# EAGLE board AQ32_v2 (EAGLE 7.3.0)
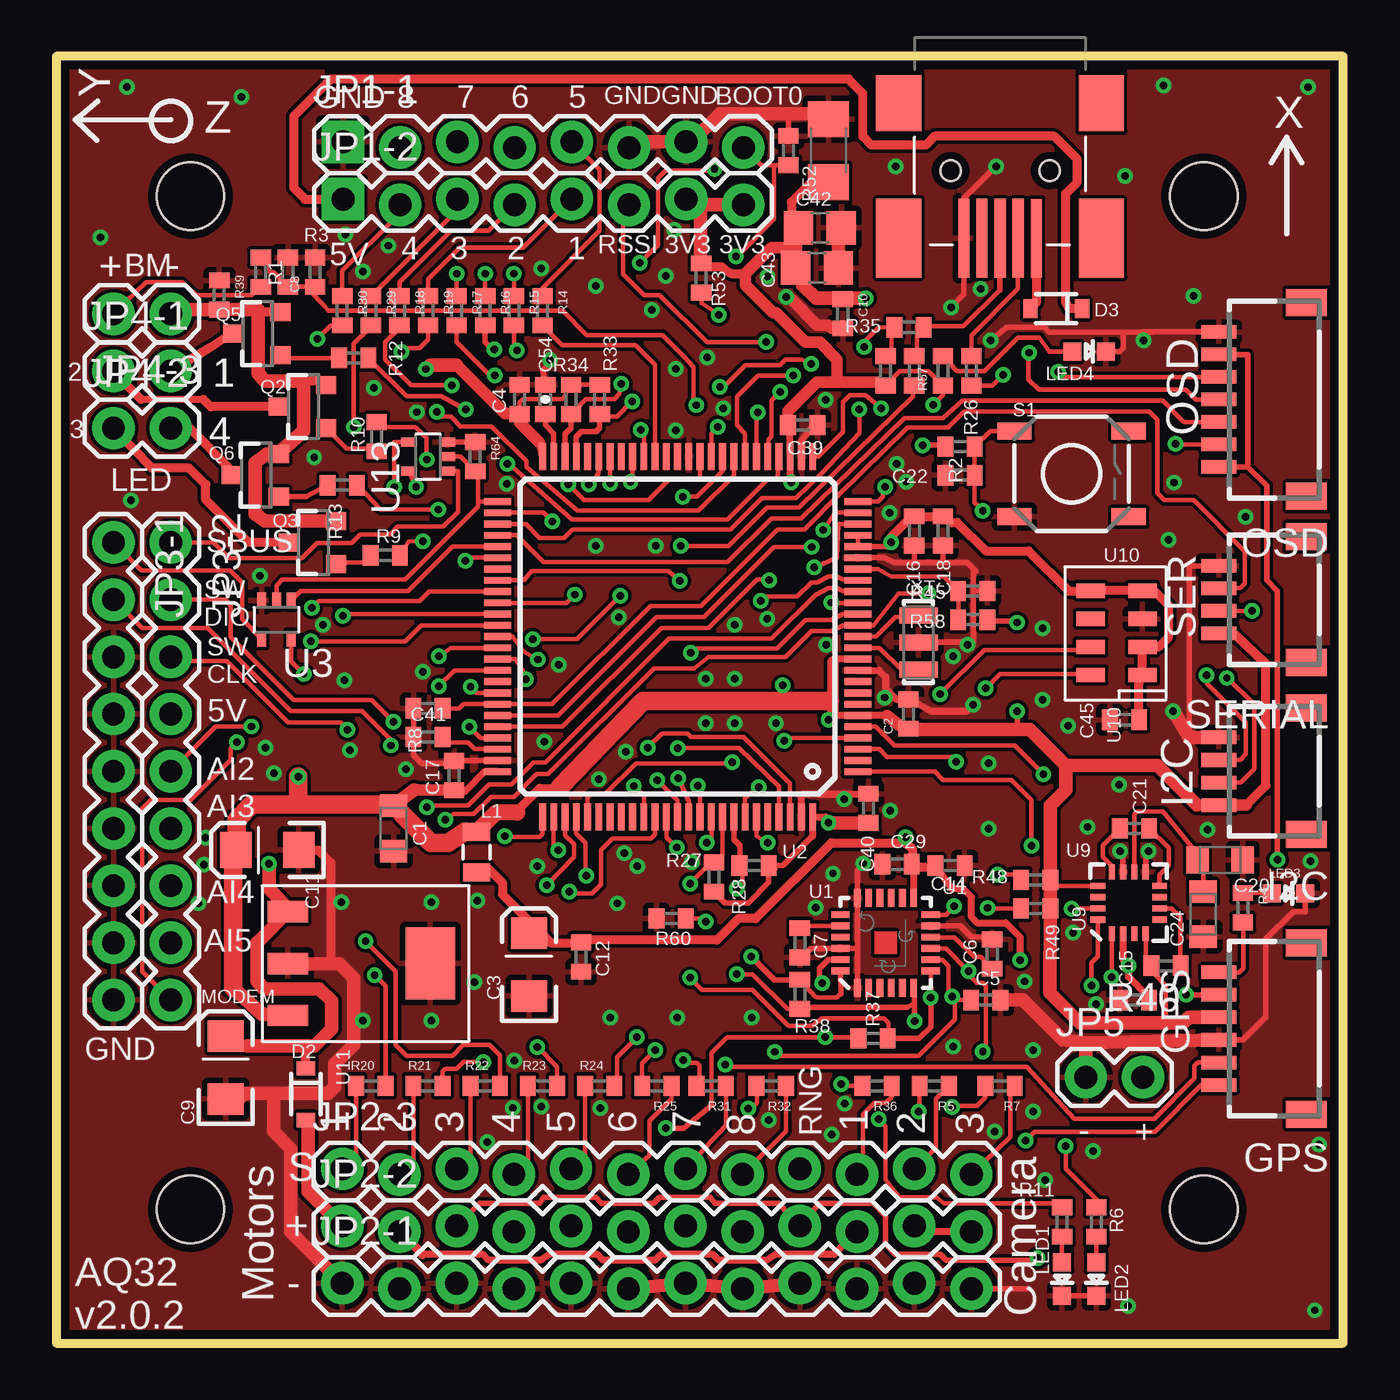
[diagram p1: board, top side]
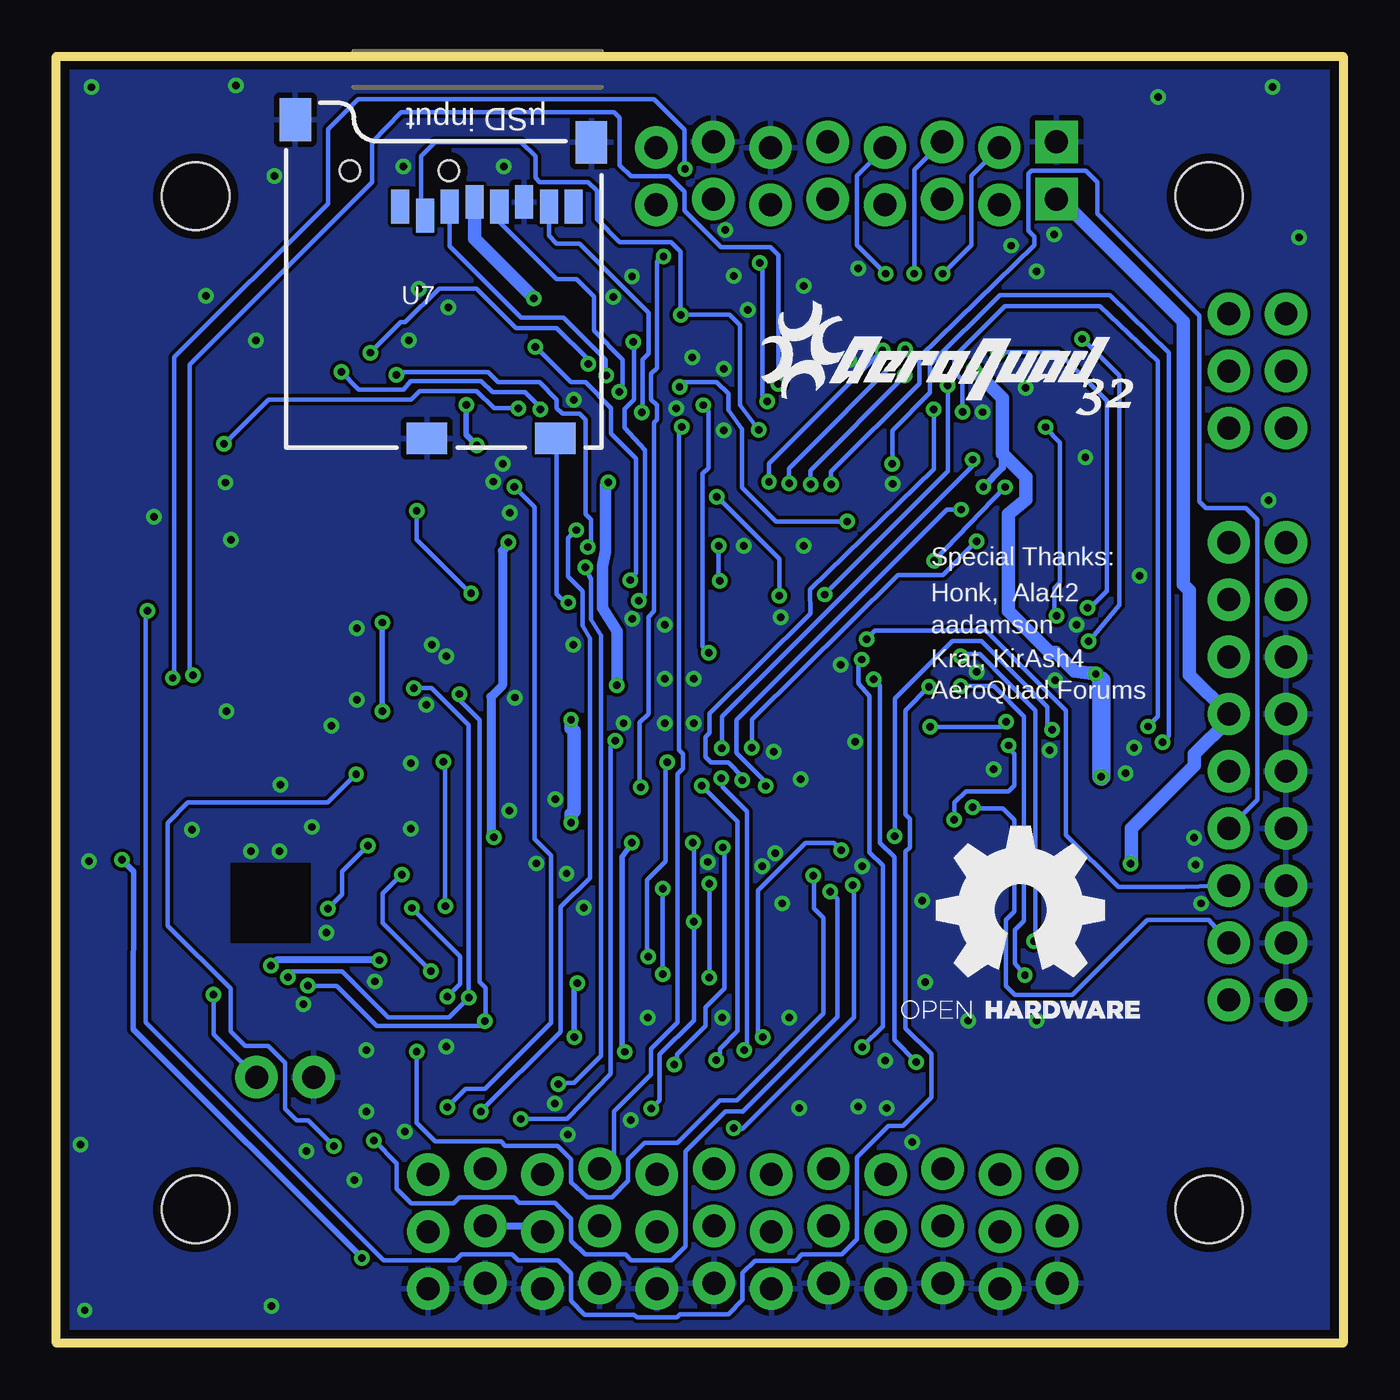
[diagram p2: board, bottom side, seen from below]

Size 57.15 x 57.15 mm. Coordinates in mm from the lower left corner, seen from the top.
Outline: 0,0 57.15,0 57.15,57.15 0,57.15 0,0
Copper layers (1*16): Top 0.0356mm / dielectric 1.5011mm / Bottom 0.0356mm
Design rules "LaenPCBOrder": minimum track width 6mil, minimum drill 13mil, track to track 6mil, track to pad 6mil, pad to pad 6mil, via to via 6mil, smd to smd 6mil, copper to edge 15mil, drill to drill 6mil, minimum pad ring 7mil, minimum via ring 7mil, stop-mask expansion 4mil, vias tented up to drill 0mil, thermal gap 10mil
Net classes: 0 default: width 0.203 mm; 1 vcc: width 0.254 mm
Holes 3 mm at 5.96,50.94 50.96,50.94 50.96,5.94 5.96,5.94
tRestrict: area 46.6,18.5 to 48.6,20.6
bRestrict: area 45.8,17.8 to 49.4,21.3

## Footprints (pad centres in the part's own frame; a part is rotated, then mirrored left to right if it is on the bottom)
SMC_Z = smd 1 x 1.2: + -1,0; - 1,0
C0402 = smd 0.7 x 0.9: 1 -0.65,0; 2 0.65,0
EIA3216 = smd 1.4 x 1.6: A 1.4,0; C -1.4,0
C0805 = smd 1.3 x 1.5: 1 -0.95,0; 2 0.95,0
C1206 = smd 1.6 x 1.8: 1 -1.4,0; 2 1.4,0
0402-CAP = smd 0.7 x 0.9: 1 -0.65,0; 2 0.65,0
SOD-323 = smd 0.63 x 0.83: 1 -1.15,0; 2 1.15,0
SM06B-SRSS-TB = smd 0.6 x 1.55: 1 -2.5,2.975; 2 -1.5,2.975; 3 -0.5,2.975; 4 0.5,2.975; 5 1.5,2.975; 6 2.5,2.975 | smd 1.2 x 1.8: FIT@1 -3.8,-0.9; FIT@2 3.8,-0.9
SM04B-SRSS-TB = smd 0.6 x 1.55: 1 -1.5,2.975; 2 -0.5,2.975; 3 0.5,2.975; 4 1.5,2.975 | smd 1.2 x 1.8: FIT@1 -2.8,-0.9; FIT@2 2.8,-0.9
1X08_LOCK = drill 1.016 pad 1.88 square: 1 0,0.127 | drill 1.016 pad 1.88: 2 2.54,-0.127; 3 5.08,0.127; 4 7.62,-0.127; 5 10.16,0.127; 6 12.7,-0.127; 7 15.24,0.127; 8 17.78,-0.127
1X12_LOCK = drill 1.016 pad 1.88: 1 0,0.127; 2 2.54,-0.127; 3 5.08,0.127; 4 7.62,-0.127; 5 10.16,0.127; 6 12.7,-0.127; 7 15.24,0.127; 8 17.78,-0.127; 9 20.32,0.127; 10 22.86,-0.127; 11 25.4,0.127; 12 27.94,-0.127
1X09 = drill 1.016 pad 1.88: 1 0,0; 2 2.54,0; 3 5.08,0; 4 7.62,0; 5 10.16,0; 6 12.7,0; 7 15.24,0; 8 17.78,0; 9 20.32,0
1X02 = drill 1.016 pad 1.88: 1 0,0; 2 2.54,0
0805 = smd 0.8 x 1.2: 1 -0.9,0; 2 0.9,0
LED-0603 = smd 0.8 x 0.8: A 0,-0.75; C 0,0.75
SM07B-SRSS-TB = smd 0.6 x 1.55: 1 -3,2.975; 2 -2,2.975; 3 -1,2.975; 4 0,2.975; 5 1,2.975; 6 2,2.975; 7 3,2.975 | smd 1.2 x 1.8: FIT@1 -4.3,-0.9; FIT@2 4.3,-0.9
SOT23-3 = smd 0.8 x 0.9: 1 -0.95,-1; 2 0.95,-1; 3 0,1.1
R0402 = smd 0.7 x 0.9: 1 -0.65,0; 2 0.65,0
TACTILE_SWITCH_SMD = smd 1.524 x 0.762: 1 -2.54,1.905; 2 2.54,1.905; 3 -2.54,-1.905; 4 2.54,-1.905
QFN-24 = smd 0.8 x 0.3: 1 -2,1.25; 2 -2,0.75; 3 -2,0.25; 4 -2,-0.25; 5 -2,-0.75; 6 -2,-1.25; 13 2,-1.25; 14 2,-0.75; 15 2,-0.25; 16 2,0.25; 17 2,0.75; 18 2,1.25 | smd 0.3 x 0.8: 7 -1.25,-2; 8 -0.75,-2; 9 -0.25,-2; 10 0.25,-2; 11 0.75,-2; 12 1.25,-2; 19 1.25,2; 20 0.75,2; 21 0.25,2; 22 -0.25,2; 23 -0.75,2; 24 -1.25,2
TQFP100 = smd 1.2 x 0.3: 1 -8,6; 2 -8,5.5; 3 -8,5; 4 -8,4.5; 5 -8,4; 6 -8,3.5; 7 -8,3; 8 -8,2.5; 9 -8,2; 10 -8,1.5; 11 -8,1; 12 -8,0.5; 13 -8,0; 14 -8,-0.5; 15 -8,-1; 16 -8,-1.5; 17 -8,-2; 18 -8,-2.5; 19 -8,-3; 20 -8,-3.5; 21 -8,-4; 22 -8,-4.5; 23 -8,-5; 24 -8,-5.5; 25 -8,-6; 51 8,-6; 52 8,-5.5; 53 8,-5; 54 8,-4.5; 55 8,-4; 56 8,-3.5; 57 8,-3; 58 8,-2.5; 59 8,-2; 60 8,-1.5; 61 8,-1; 62 8,-0.5; 63 8,0; 64 8,0.5; 65 8,1; 66 8,1.5; 67 8,2; 68 8,2.5; 69 8,3; 70 8,3.5; 71 8,4; 72 8,4.5; 73 8,5; 74 8,5.5; 75 8,6 | smd 0.3 x 1.2: 26 -6,-8; 27 -5.5,-8; 28 -5,-8; 29 -4.5,-8; 30 -4,-8; 31 -3.5,-8; 32 -3,-8; 33 -2.5,-8; 34 -2,-8; 35 -1.5,-8; 36 -1,-8; 37 -0.5,-8; 38 0,-8; 39 0.5,-8; 40 1,-8; 41 1.5,-8; 42 2,-8; 43 2.5,-8; 44 3,-8; 45 3.5,-8; 46 4,-8; 47 4.5,-8; 48 5,-8; 49 5.5,-8; 50 6,-8; 76 6,8; 77 5.5,8; 78 5,8; 79 4.5,8; 80 4,8; 81 3.5,8; 82 3,8; 83 2.5,8; 84 2,8; 85 1.5,8; 86 1,8; 87 0.5,8; 88 0,8; 89 -0.5,8; 90 -1,8; 91 -1.5,8; 92 -2,8; 93 -2.5,8; 94 -3,8; 95 -3.5,8; 96 -4,8; 97 -4.5,8; 98 -5,8; 99 -5.5,8; 100 -6,8
SC70-5 = smd 0.4 x 0.7: 1 -0.65,-0.85; 2 0,-0.85; 3 0.65,-0.85; 4 0.65,0.85; 5 -0.65,0.85
MICRO-SD-SOCKET-PP = smd 0.8 x 1.5: 1 -8.94,10.7; 2 -7.84,10.3; 3 -6.74,10.7; 4 -5.64,10.9; 5 -4.54,10.7; 6 -3.44,10.9; 7 -2.34,10.7; 8 -1.24,10.7 | smd 1.8 x 1.4: CD1 -2.05,0.4; CD2 -7.75,0.4 | smd 1.4 x 1.9: GND1 -13.6,14.55; GND3 -0.45,13.55
16LPCC = smd 0.65 x 0.28: 1 -1.37,0.75; 2 -1.37,0.25; 3 -1.37,-0.25; 4 -1.37,-0.75; 9 1.37,-0.75; 10 1.37,-0.25; 11 1.37,0.25; 12 1.37,0.75 | smd 0.28 x 0.65: 5 -0.75,-1.37; 6 -0.25,-1.37; 7 0.25,-1.37; 8 0.75,-1.37; 13 0.75,1.37; 14 0.25,1.37; 15 -0.25,1.37; 16 -0.75,1.37
LGA08A = smd 1.27 x 0.635: 1 -1.15,1.9; 2 -1.15,0.65; 3 -1.15,-0.6; 4 -1.15,-1.85; 5 1.15,-1.85; 6 1.15,-0.6; 7 1.15,0.65; 8 1.15,1.9
TO-223 = smd 3.2 x 2.2: 1 0,6.311 | smd 0.95 x 1.8: 2 -2.3,-0.014; 3 2.3,-0.014; 4 0,-0.014
USB-MINIB-OLD = smd 2.5 x 2: 1 -3,-4.5; 2 -3,4.5 | smd 3.5 x 2: 3 3,-4.5; 4 3,4.5 | smd 3.5 x 0.5: D+ 3,0; D- 3,0.8; GND 3,-1.6; ID 3,-0.8; VBUS 3.01,1.61 | hole 0.9: 0,2.2; 0,-2.2
RESONATOR-SMD = smd 0.7 x 1.7: 1 -1.2,0; 2 0,0; 3 1.2,0

## Placement (x,y rotation side)
C1  4.7uF  [SMC_Z]  14.99,22.86 270 top
C2  0.1uF  [C0402]  37.85,27.94 90 top
C3  10uF  [EIA3216]  20.99,16.82 90 top
C4  0.1uF  [C0402]  20.57,41.91 90 top
C5  10nF  [C0402]  41.27,15.24 0 top
C6  0.1uF  [C0402]  41.56,17.29 90 top
C7  2.2nF  [C0402]  33.02,17.78 270 top
C8  0.1µF  [C0402]  11.49,47.56 90 top
C9  10uF (25V)  [EIA3216]  7.53,12.24 90 top
C10  0.1uF  [C0402]  34.92,45.72 270 top
C11  10uF  [EIA3216]  9.37,21.9 180 top
C12  0.1uF  [C0402]  23.3,17.14 270 top
C14  1uF  [C0402]  39.69,21.21 0 top
C15  0.1uF  [C0402]  47.88,15.24 180 top
C16  1uF  [C0402]  38.1,36.07 270 top
C17  0.1uF  [C0402]  17.66,25.21 90 top
C18  10nF  [C0402]  39.37,36.07 270 top
C20  1uF (ESR)  [SMC_Z]  51.69,21.46 0 top
C21  0.22uF  [C0402]  47.88,22.86 180 top
C22  0.1uF  [C0402]  40.13,38.54 0 top
C24  1uF (ESR)  [SMC_Z]  50.93,19.05 270 top
C29  0.1uF  [C0402]  37.34,21.27 180 top
C39  0.1uF  [C0402]  33.15,40.77 0 top
C40  0.1uF  [C0402]  36.07,23.75 90 top
C41  2.2uF  [C0402]  16.51,26.92 180 top
C42  47uF  [C0805]  33.91,49.53 0 top
C43  10uF  [C0805]  33.78,47.75 0 top
C44  220uF  [C1206]  34.29,52.96 90 top
C45  0.1uF  [C0402]  47.43,27.69 180 top
C54  2.2uF  [0402-CAP]  21.72,41.91 270 top
D2  30V  [SOD-323]  11.08,11.06 270 top
D3  30V  [SOD-323]  44.41,45.94 180 top
GPS  SM06B-SRSS-TB  [SM06B-SRSS-TB]  54.61,13.97 90 top
I2C  SM04B-SRSS-TB  [SM04B-SRSS-TB]  54.61,25.4 90 top
JP1-1  JP1  [1X08_LOCK]  12.73,53.22 0 top
JP1-2  JP1  [1X08_LOCK]  12.73,50.68 0 top
JP2-1  M12LOCK  [1X12_LOCK]  12.7,2.54 0 top
JP2-2  M12LOCK  [1X12_LOCK]  12.7,5.08 0 top
JP2-3  M12LOCK  [1X12_LOCK]  12.7,7.62 0 top
JP3-1  M09  [1X09]  2.54,35.56 270 top
JP3-2  M09  [1X09]  5.08,35.56 270 top
JP4-1  JP4  [1X02]  2.54,43.18 0 top
JP4-2  JP4  [1X02]  2.54,40.64 0 top
JP4-3  JP4-3  [1X02]  5.08,45.72 180 top
JP5  [1X02]  45.72,11.81 0 top
L1  100uH  [0805]  18.67,21.81 270 top
LED1  Blue  [LED-0603]  44.66,2.85 180 top
LED2  Green  [LED-0603]  46.19,2.85 180 top
LED3  Blue  [LED-0603]  54.73,19.97 270 top
LED4  Blue  [LED-0603]  45.87,44.04 270 top
OSD  SM07B-SRSS-TB  [SM07B-SRSS-TB]  54.61,41.91 90 top
Q2  BCV27  [SOT23-3]  10.99,41.59 90 top
Q3  BCV27  [SOT23-3]  11.43,35.56 90 top
Q5  BCV27  [SOT23-3]  8.95,44.83 90 top
Q6  BCV27  [SOT23-3]  8.89,38.54 90 top
R1  10K  [C0402]  9.08,47.56 270 top
R2  10K  [C0402]  40.13,39.81 180 top
R3  1k5  [C0402]  10.29,47.56 270 top
R4  330  [C0402]  52.69,19.34 270 top
R5  1K  [C0402]  38.99,11.43 180 top
R6  330  [C0402]  46.19,5.39 270 top
R7  1K  [C0402]  41.91,11.43 180 top
R8  10k  [R0402]  16.51,28.19 0 top
R9  1k69  [C0402]  14.61,34.99 180 top
R10  1k69  [C0402]  14.22,40.26 270 top
R11  330  [C0402]  44.66,5.39 90 top
R12  1k69  [C0402]  13.21,43.75 180 top
R13  1k69  [C0402]  12.7,38.1 180 top
R14  1K  [C0402]  21.59,45.85 270 top
R15  1K  [C0402]  20.32,45.85 270 top
R16  1K  [C0402]  19.05,45.85 270 top
R17  1K  [C0402]  17.78,45.85 270 top
R18  1K  [C0402]  15.24,45.85 270 top
R19  1K  [C0402]  16.51,45.85 270 top
R20  1K  [C0402]  13.97,11.43 0 top
R21  1K  [C0402]  16.51,11.43 0 top
R22  1K  [C0402]  19.05,11.43 0 top
R23  1K  [C0402]  21.59,11.43 0 top
R24  1K  [C0402]  24.13,11.43 0 top
R25  1K  [C0402]  26.67,11.43 180 top
R26  22R  [C0402]  40.64,43.18 90 top
R27  4k7  [C0402]  29.21,20.7 90 top
R28  4k7  [C0402]  30.99,21.21 180 top
R29  1K  [C0402]  13.97,45.85 270 top
R30  1K  [C0402]  12.7,45.85 270 top
R31  1K  [C0402]  29.08,11.43 180 top
R32  1K  [C0402]  31.75,11.43 180 top
R33  4k7  [C0402]  24.13,41.91 270 top
R34  4k7  [C0402]  22.86,41.91 270 top
R35  22R  [C0402]  37.87,45.11 0 top
R36  1K  [C0402]  36.45,11.43 180 top
R37  0R  [R0402]  36.27,13.54 0 top
R38  0R  [R0402]  33.02,15.49 270 top
R39  0R  [C0402]  7.24,46.55 270 top
R40  0R  [R0402]  49.28,16.76 180 top
R45  0R  [R0402]  40.7,33.4 180 top
R48  4k7  [C0402]  43.5,20.57 180 top
R49  4k7  [C0402]  43.5,19.3 180 top
R52  10K  [C0402]  32.51,52.96 270 top
R53  4k7  [C0402]  28.64,47.31 270 top
R57  330  [C0402]  39.37,43.18 90 top
R58  0R  [R0402]  40.7,32.13 180 top
R60  10k  [R0402]  27.3,18.86 180 top
R61  1K5  [R0402]  36.83,43.18 90 top
R62  220R  [C0402]  38.1,43.18 270 top
R64  10K  [C0402]  18.61,39.37 270 top
S1  SW-MOM  [TACTILE_SWITCH_SMD]  45.09,38.61 0 top
SERIAL  SM04B-SRSS-TB  [SM04B-SRSS-TB]  54.61,33.02 90 top
U1  ITG-3200  [QFN-24]  36.83,17.78 90 top
U2  STM32F10XVXT6  [TQFP100]  27.59,31.38 180 top
U3  74AHC1G86DCK  [SC70-5]  9.78,32.13 180 top
U7  USD-SOCKETNEW  [MICRO-SD-SOCKET-PP]  32.94,39.78 0 bottom
U9  HMC5883LSMD  [16LPCC]  47.62,19.56 90 top
U10  MS5611  [LGA08A]  47.08,31.57 180 top
U11  MIC5239  [TO-223]  10.3,16.86 270 top
U13  74AHC1G86DCK  [SC70-5]  16.51,39.37 90 top
U$4  [AQ-WORDS-PT07]  25.84,40.87 0 bottom
U$5  [OSHW_TEXT]  19.62,14.41 0 bottom
X2  USBOLD  [USB-MINIB-OLD]  41.91,52.07 270 top
XT  8MHz  [RESONATOR-SMD]  38.29,31.11 270 top

## Tracks (layer width: path | path; a pad name or v marks a point on that pad's centre or on a via)
3V3AN  (via drill 0.33 pad 0.69)
  Top 0.203: U2.21 U2.22 | C18.1 39.41,36.72 39.68,36.45 | C3.A 20.99,18.32 21.21,18.54
  Top 0.254: 37.85,36.58 37.96,36.58 C16.1 | 45.97,33.59 U10.5 45.91,33.4 | 48.77,33.4 48.63,33.4 U10.4 | 48.08,29.31 U10.1 | U2.21 36.9,35.38 v37.08,35.56 | C29.1 38.08,21.14
  Top 0.305: U1.13 38.08,21.14 | v37.72,22.48 37.72,22.19 | v42.8,17.02 42.8,18.03 42.16,18.67 40.89,18.67 40.64,18.92 40.64,19.81 40.26,20.19 39.75,20.19 C14.1 | C15.1 48.53,15.35 47.62,16.26 v47.62,16.76 47.38,17.01 U9.2
  Top 0.406: U10.1 U10.2 48.95,30.92 49.4,31.37 49.4,32.77 48.77,33.4 | U10.4 U10.5 | v37.08,35.56 37.08,35.81 37.85,36.58 | C16.1 C18.1 | C45.1 48.08,29.31 | L1.2 19.22,21.04 19.81,20.45 19.81,19.94 21.21,18.54 21.97,17.78 23.07,17.78 C12.1 23.67,17.91 29.34,17.91 30.29,18.86 31.05,18.86 34.42,22.23 37.47,22.23 v37.72,22.48 | 37.72,22.19 38.01,21.97 38.01,21.3 C29.1 | 39.68,36.45 40.01,36.45 41.27,35.18 43.18,35.18 44.96,33.4 45.91,33.4 | 38.08,21.14 38.97,21.14 C14.1
  Bottom 0.254: 37.85,22.61 v37.72,22.48
  Bottom 0.305: v42.8,17.02 47.37,17.02 v47.62,16.76
  Bottom 0.406: v37.08,35.56 37.34,35.18 37.34,29.21 37.85,28.7 37.85,22.61
3V3DIG  (via drill 0.33, 0.33 pad 0.69)
  Top 0.203: R58.1 41.51,32.07 | U13.5 16.01,37.96 16.01,38.06 v15.98,38.02 | R28.1 31.95,21.07 | 33.59,22.58 33.59,22.53 | 33.59,22.53 | R61.1 36.83,42.55 37.47,43.18 38.73,43.18 38.73,43.16 R57.1 39.37,42.1 v38.95,41.67 | C4.1 20.57,41.78 20.72,41.93 22.48,41.93 R34.1 R33.1 | U9.13 44.41,20.31 R48.1 | U9.4 48.38,17.02 R40.2 48.75,16.4 49.28,15.88 49.28,14.47 49.53,14.22 | 49.28,14.22 49.78,14.22 | U3.5 10.43,30.27 v10.99,29.72 | C10.1 34.16,46.41
  Top 0.254: C44.1 33.52,51.56 | 32.64,49.81 32.64,49.59 C42.1 | 41.51,32.07 42.61,32.07 v42.67,32 | v42.67,28.07 42.67,27.5 42.92,27.25 | v38.48,39.88 39.42,39.88 R2.2 | 33.59,22.53 32.27,21.21 R28.1 31.64,20.46 30.73,19.56 29.7,19.56 R27.1 | 32.59,38.28 v32.64,38.23 | 32.59,40.8 C39.1
  Top 0.305: 36.89,27.88 U2.6 34.48,27.88 34.29,27.75 v34.29,27.69 | 33.59,22.53 U2.100 34.17,23.38 v34.29,23.11 | 34.35,28.52 34.48,28.64 | 44.8,24.66 44.84,24.57 | 52.39,31.43 51.72,31.43 SERIAL.1 | R53.1 29,47.8 | U2.50 21.46,40.01 | 20.43,41.27 C4.1 | C40.1 36.07,23.11 | C2.1 37.85,27.39 | U2.75 19.03,25.38 18.16,24.51 17.74,24.51 C17.1 | 32.59,38.28 U2.28 32.59,40.8 | U2.11 34.61,30.38 34.48,30.25
  Top 0.406: 38.08,27.27 37.85,27.39 37.5,27.39 | 52.39,31.43 53.72,30.16 53.72,24.77 52.86,23.9 | 33.52,51.56 32.64,50.67 32.64,49.81 | 29,47.8 29.54,47.8 29.97,47.5 30.61,47.5 | C11.A 8.03,21.9 7.85,21.97 | 10.24,14.61 U11.3 | L1.1 18.9,22.73 18.16,22.73 | C1.+ 14.73,23.93 15.37,24.18 15.37,23.5 | I2C.1 50.65,23.9 | 20.47,23.56 20.47,23.64 21.46,24.64 22.23,24.64 22.35,24.68 | v32.26,29.21 32.26,28.64 32.13,28.52 | 32.64,41.04 C39.1 | 36.81,42.55 R61.1 36.56,42.67
  Top 0.508: 37.5,27.39 36.89,27.88 | 34.48,27.88 34.48,28.64 34.48,30.25 | 21.46,40.01 20.57,40.89 C4.1 | 17.78,43.43 19.94,41.27 20.43,41.27 | 15.88,24.56 C17.1 | C39.1 32.5,41.39 33.78,42.67 34.54,42.67 | I2C.1 52.86,23.9 | 34.54,42.67 36.56,42.67 | 32.83,48.64 31.75,48.64 30.61,47.5 30.61,46.99 31.83,45.77 31.96,45.77 33.27,44.45 33.91,44.45 34.67,43.69 34.67,42.8 34.54,42.67
  Top 0.61: GPS.4 50.28,14.47 50.03,14.22 49.78,14.22 49.53,14.22 45.46,14.22 44.12,15.56 R49.1 R48.1 44.15,23.89 44.84,24.57 44.84,25.65 | 17.78,43.43 16.59,43.43 v16.42,43.26 | v34.29,23.11 36.07,23.11 | JP1-2.7 28.61,50.56 | 28.61,50.56 JP1-2.8 | 7.85,15.78 9.14,14.61 10.24,14.61 | 15.37,24.18 15.88,24.56 | 50.65,23.9 48.9,25.65 44.84,25.65 | 44.84,25.65 43.24,27.25 42.92,27.25 37.88,27.25 C2.1 | R53.1 28.61,47.96 28.61,50.56 | C43.1 32.83,48.64 32.83,49.4 C42.1 | 33.02,47.56 C43.1 | v35.94,46.41 34.16,46.41 33.73,46.41 33.15,46.99 33.15,47.44 C43.1
  Top 0.711: 20.47,23.56 19.52,23.56 L1.1
  Top 0.813: 34.35,28.52 32.13,28.52 26.05,28.52 22.35,24.68 | 7.85,21.97 7.85,15.78 | 15.37,23.5 16.64,22.23 17.4,22.23 18.16,22.73 | 14.73,23.93 10.79,23.93 | 10.79,23.93 8.69,23.93 8,23.24 8,21.93 C11.A | v10.74,25.16 10.74,23.98 10.79,23.93
  Bottom 0.203: 11.15,29.75 v10.99,29.72
  Bottom 0.254: v42.67,32 v42.67,28.07 | v38.95,41.67 38.95,40.34 v38.48,39.88
  Bottom 0.305: v15.98,38.02 15.12,38.88 15.12,39.5
  Bottom 0.406: v32.64,38.23 32.77,38.1
  Bottom 0.508: 32.77,38.1 32.77,35.18 32.89,34.54 32.89,32.64 32.26,31.62 v32.26,29.21
  Bottom 0.61: 10.74,29.44 11.15,29.75 | v34.29,23.11 34.29,23.5 34.16,23.62 34.16,27.18 34.29,27.3 v34.29,27.69 | v10.99,29.72 11.94,29.84 12.76,30.67 13.02,30.67 14.86,32.51 14.86,36.83 14.1,37.47 14.1,38.47 15.12,39.5 15.12,41.96 v16.42,43.26 | U7.4 38.58,49.04 v35.94,46.41
  Bottom 0.813: v10.74,25.16 10.74,29.44
5V-1
  Top 0.406: 11.18,9.81 D2.2
  Top 0.61: JP2-2.1 11.18,6.73 11.18,9.81
5V-2
  Top 0.305: JP2-2.10 34.54,3.94 31.93,3.94 31.55,3.68 29.43,3.68 29.17,3.94 26.85,3.94 26.59,3.68 24.28,3.68 24.03,3.94 21.89,3.94 21.51,3.68 19.2,3.68 18.95,3.94 16.26,3.94 | JP2-2.12 38.35,4.95 JP2-2.11
  Top 0.406: 16.26,3.94 JP2-2.2
  Bottom 0.305: JP2-2.11 35.81,5.21 JP2-2.10
5V-3  (via drill 0.33)
  Top 0.254: 52.92,38.91 53.75,38.08 53.75,33.88 54.23,33.4 v54.23,21.46 | JP2-2.3 18.8,6.22 21.45,6.22 21.64,6.48 23.96,6.48 24.22,6.22 26.53,6.22 26.79,6.48 29.05,6.48 29.25,6.21 32.08,6.21 JP2-2.9 33.9,6.21 36.28,6.21 36.83,5.66 36.83,4.42 37.24,3.95 39.26,3.95 39.52,3.68 43.57,3.68 v43.57,3.78 | OSD.1 52.92,38.91 | OSD.6 52.92,43.91 52.92,38.91
  Bottom 0.203: v43.57,3.78 v43.58,3.78
  Bottom 0.254: v54.23,21.46 53.72,20.95 53.73,13.93 v43.58,3.78
5VIN  (via drill 0.33 pad 0.69)
  Top 0.254: U11.2 10.46,19.16
  Top 0.305: 12.68,50.86 JP1-2.1
  Top 0.406: D2.1 11.08,13.2 | 8.48,13.2 C9.A | 8.91,17.81 8.93,17.81 | D3.1 44.99,45.94 44.83,46.23 44.83,51.05 45.34,51.56 45.34,52.58 44.32,53.59 38.99,53.59 38.61,53.21 36.2,53.21 35.81,53.59 35.81,55.5 35.18,56.13 12.19,56.13 10.54,54.48 10.54,51.31 11.05,50.8 JP1-2.1
  Top 0.61: 8.91,17.81 8.91,16.07 9.24,15.74 11.68,15.74 12.23,15.19 12.23,13.95 11.48,13.2 11.08,13.2 8.48,13.2 | 10.46,19.16 9.45,20.17 v9.45,21.29 | 8.93,17.81 U11.2
  Bottom 0.61: JP1-2.1 12.6,50.86 7.1,45.36 7.1,33.7 6.82,33.42 6.82,29.68 JP3-2.4 5.08,27.69 6.6,26.16 6.6,25.65 9.4,22.86 9.4,21.34 v9.45,21.29
ADC12_IN14  (via drill 0.33 pad 0.69)
  Top 0.203: U2.33 30.09,38.53 28.53,36.97 23.14,36.97 20.87,38.91 20.87,39.17 19.33,40.72 17.96,40.72 17.53,41.15 17.12,41.15 v16.9,41.36 | v8.67,27.39 7.07,27.39 JP3-2.5
  Bottom 0.203: v8.67,27.39 8.23,27.84 8.23,43.62 10.8,46.06 15.02,46.06 17.27,43.81 17.27,43.14 16.9,42.77 v16.9,41.36
ADC12_IN15  (via drill 0.33 pad 0.69)
  Top 0.203: v25.04,33.19 23.12,31.27 v21.15,31.27 | U2.34 29.59,38.72 28.46,37.59 v27.82,37.59
  Bottom 0.203: v21.15,31.27 20.79,31.66 15.88,31.66 12.32,28.1 12.32,22.57 9.99,20.25 7.05,20.25 JP3-2.7 | v27.82,37.59 25.04,34.82 v25.04,33.19
ADC123_IN10  (via drill 0.33 pad 0.69)
  Top 0.203: R1.1 9.48,47.56 9.65,47.56 10.03,47.18 R3.2 C8.1 11.18,46.8 11.94,46.04 12.06,45.85 22.48,45.85 23.56,44.77 26.92,44.77 27.88,43.81 28.3,43.34 28.3,41.79 v28.42,41.66 | v28.17,30.66 28.37,30.86 32,30.86 33.27,32.13 34.41,32.13 34.92,32.38 U2.15
  Bottom 0.203: v28.42,41.66 28.38,41.53 28.19,41.4 28.19,38.86 28.45,38.61 28.45,30.94 v28.17,30.66
ADC123_IN11  (via drill 0.33 pad 0.69)
  Top 0.203: U2.16 34.56,32.88 v34.42,32.89
  Bottom 0.203: v34.42,32.89 34.54,32.89 34.92,33.27 34.92,39.35 U7.CD1
ADC123_IN12  (via drill 0.33 pad 0.69)
  Top 0.203: v16.45,23.8 16.65,23.88 18.29,23.88 19.22,24.81 20.22,24.81 21.19,25.78 21.72,25.78 27.22,31.28 31.77,31.28 33.74,33.25 33.76,33.25 34.29,33.53 34.67,33.53 34.92,33.4 35.57,33.4 U2.17
  Bottom 0.203: JP3-2.8 5.97,18.8 8.7,18.8 12.02,15.47 14.58,15.47 14.99,15.88 14.99,18.8 14.61,19.18 14.61,23.24 15.11,23.75 16.4,23.75 v16.45,23.8
ADC123_IN13  (via drill 0.33 pad 0.69)
  Top 0.203: v31.28,32.97 31.47,33.16 32.9,33.16 33.53,33.78 33.78,33.78 34.29,34.04 34.67,34.04 34.92,33.91 35.56,33.91 U2.18 | v31.52,44.46 31.51,44.45 28.89,44.45 26.8,46.55 26.1,46.55 25.18,47.47 25.18,50.3 JP1-2.6
  Bottom 0.203: v31.28,32.97 31,33.25 31,39.67 31.92,40.66 31.92,41.49 31.5,41.91 31.5,44.44 v31.52,44.46
BOOT0  (via drill 0.33 pad 0.69)
  Top 0.203: 30.11,48.39 30.18,48.45 v30.18,48.26 30.22,48.26 31.88,49.91 31.88,52.31 | U2.94 30.59,24.22 v31.19,24.7 | R52.2 31.88,52.31 | 31.88,52.31 31.3,52.31 JP1-1.8
  Bottom 0.203: 31.18,24.84 v31.19,24.7 31.24,24.75 31.24,27.56 30.86,27.94 30.86,32.26 30.61,32.51 30.61,40.89 30.48,41.02 30.48,41.66 30.73,41.91 30.73,43.05 30.48,43.31 30.48,48.02 v30.18,48.26
GND  (via drill 0.33 pad 0.69)
  Top 0.254: 40.72,34.41 40.72,33.4 | v21.93,43.66 21.93,43.53 21.59,43.19 C54.1 | 17.11,40.02 U13.3 R64.1 | 50.33,26.9 50.33,34.52 SERIAL.4 | C7.2 33.37,17.38 33.51,17.53 U1.22 35.58,17.53 | R8.1 C41.2 15.86,26.1 16.22,25.73 17.63,25.73 | U2.74 17.65,25.88 17.63,25.73 | LED3.C 55.48,19.16 54.92,19.16 53.72,17.96 53.72,14.5 52.69,13.47 GPS.3 | 40.72,33.4 40.72,31.14 39.07,31.13 XT.2 | 43.1,2.41 JP2-1.12 | LED2.C LED1.C | v35.82,21.3 35.58,21 U1.18 35.58,17.53 | U1.1 35.58,17.53 | 47.39,44.91 44.09,44.91 43.88,45.12 42.21,45.12 v41.49,44.53 | LED4.C 47.22,44.04 47.39,44.21 47.39,44.91 | OSD.7 48.27,44.92 48.26,44.91 | v39.74,46 40.31,46.58 X2.GND 40.31,50.84 v41.73,52.26 | 47.39,44.91 48.26,44.91 | 48.26,44.91 48.73,44.91 | 17.63,25.73 C17.2 | R45.1 40.72,33.4 | 39.37,34.66 38.1,34.66 | 38.1,34.66 37.22,34.66 36.75,34.88 U2.20 | C16.2 38.1,34.66 | C18.2 39.37,34.66 | 39.37,34.66 40.47,34.66 40.72,34.41 | R52.1 32.51,54.61 | 40.84,34.29 40.72,34.41 | U9.11 47.38,21.71 v47.24,21.84 | U9.9 48.38,21.7 v48.51,21.84 | U1.11 40.14,18.53 40.64,18.03 41.53,18.03 C6.2 | 35.05,49.53 C42.2 34.73,49.4 | 34.42,53.72 34.42,54.23 C44.2
  Top 0.305: U2.99 33.09,24.33 33.15,24.38 35.83,24.38 C40.2 | U2.10 36.54,29.88 36.83,29.59 36.83,29.08 37.34,28.57 37.83,28.57 | 37.83,28.57 C2.2 | 37.83,28.57 37.97,28.57 38.86,28.07 40.44,28.07 v40.72,28.36 | U2.27 33.09,40.08 33.66,40.77 33.66,41.01 C39.2
  Top 0.406: 17.39,17.58 17.38,17.59 | 7.37,10.54 8.1,10.82 | C11.C 11.63,21.9 12.19,21.34 12.19,16.84
  Top 0.508: C10.2 34.43,45.07 34.29,45.21 33.78,45.21 32.64,46.35 32.51,46.35 32.38,46.48
  Top 0.61: JP2-1.6 JP2-1.7 JP2-1.8 JP2-1.9 | JP1-1.6 25.81,53.35 JP1-1.7 28.2,53.35 29.46,54.61 32.51,54.61 34.04,54.61 | I2C.4 50.33,26.9 49.63,28.04 v49.6,28.07 | C9.C 8.1,10.82 8.37,11.09 9.65,11.09 | U11.4 11.07,16.84 12.19,16.84 12.58,16.84 13.21,16.21 13.21,13.25 12.37,12.41 12.37,11.39 12.07,11.09 9.65,11.09 | U11.1 17.38,16.87 17.38,17.59 16.49,18.06 | JP2-1.1 10.41,4.95 10.41,8.64 9.65,9.4 9.65,11.09 | GPS.3 45.72,13.34 | 45.72,13.34 44.7,13.47 42.93,15.24 C5.2 | JP5.1 45.72,13.34 | C43.2 34.73,49.4
  other vias: 34.17,41.89 41.4,22.84 47.2,24.8 14.11,42.43 47.59,1.65 46.05,8.53 41.04,46.82 37.32,39.04 37.75,38.26 31.58,47.37 32.42,46.47 49.17,55.85 18.69,19.66 16.66,14.32 16.66,19.59 6.62,22.45 9.67,25.31 6.31,19.53 6.56,21.24 16.28,29.82 12.78,29.44 20.34,12.54 21.55,10.51 24.15,10.45 31.96,27.53 40.47,31.02 31.58,32.17 30.12,27.53 25.29,26.26 22.31,30.13 28.21,21.37 24.98,32.23 26.63,35.4 23.96,35.4 39.83,30.52 8.21,55.34 27.52,43.28 3.13,55.79 23.96,46.96 27.58,14.45 35.01,10.64 25.8,21.18 43.38,10.29 34.43,9.27 41.66,9.4 31.63,9.91 55.89,1.46 24.59,14.45 36.79,28.67 27.52,40.55 1.96,49.1 11.45,39.34 28.85,29.5 18.56,16.04 34.18,31.02 49.39,35.68 43.38,13.02 46.17,15.05 39.83,13.18 30.12,29.5 13.61,14.32 12.66,19.59 11.83,31.91 29.62,41.52 13.04,26.32 3.32,37.44 9.29,26.45 47.47,51.84 37.28,52.26 30.88,14.45 56.08,8.83 28.91,43.79 34.49,20.86 55.59,55.78 30.12,31.91 37,36.88 48.28,44.53 50.5,46.52 20.28,10.45 15.51,25.5 12.85,49.25 16.01,41.35 20.01,38.17 24.09,25.05 28.85,27.53 25.23,21.75 27.07,47.41 19.13,8.93 43.91,7.24 26.44,45.88 27.45,49.44 43.8,31.74 43.8,28.57 44.94,27.42 49.64,38.22 37.03,23.65 35,24.16 55.7,21.4 21.67,26.71 45.79,22.93 51.13,22.8 41.4,25.76 52.82,36.69 14.75,48.74 13.61,47.6 21.55,47.72 24.91,19.53 21.36,21.18 33.73,19.34 43,16.07 45.16,18.23 9.04,34.07
  pour Bottom: -0.1,57.08 57.01,57.02 57.1,-0.06 -0.15,0.06
  pour Top: 0,57.15 57.15,57.15 57.15,0 0,0
GND2
  Top 0.406: 8.26,45.91 8.38,45.91 | Q2.2 11.79,42.74 10.73,42.74 10.99,42.61 | 9.89,39.54 Q6.2 9.33,39.49 | Q5.2 8.96,45.78 8.95,45.78
  Top 0.61: JP4-3.1 5.83,45.9 R39.2 8.26,45.91 | 8.38,45.91 8.95,45.91 8.95,45.78 8.95,43.05 9.27,42.74 10.73,42.74 | 9.89,39.54 10.99,40.51 10.99,42.61 | Q3.2 9.27,36.51 8.83,36.83 8.83,39.12 9.33,39.49
GPSBATT  (via drill 0.33 pad 0.69)
  Top 0.254: v50.17,15.47 GPS.5
  Bottom 0.203: JP5.2 50.17,13.72 v50.17,15.47
GPSLED
  Top 0.203: GPS.6 52.54,16.47 52.7,16.64 52.7,18.67 R4.2
HMC_INT  (via drill 0.33 pad 0.69)
  Top 0.203: v45.09,19.3 U9.15 | U2.1 39.01,25.38 39.37,25.02 42.42,25.02 43.31,24.13 v43.31,22.1
  Bottom 0.203: v43.31,22.1 44.45,20.95 44.45,19.94 v45.09,19.3
ITG_CPOUT
  Top 0.203: U1.20 33.12,18.53 C7.1
ITG_INT  (via drill 0.33 pad 0.69)
  Top 0.203: U2.3 36.55,26.38 36.89,26.04 39.74,26.04 v39.96,25.82 | U1.12 39.5,19.03 v39.88,19.41
  Bottom 0.203: v39.88,19.41 39.88,25.74 v39.96,25.82
ITG_REGOUT
  Top 0.203: 41.24,16.7 C6.1 41.05,17.14 40.77,17.14 39.88,18.03 U1.10
JTAG-TRST  (via drill 0.33 pad 0.69)
  Top 0.203: v38.73,33.3 37.4,33.3 36.29,31.88 U2.14 34.92,31.88 34.42,31.63 33.53,31.63 32.38,30.48 28.96,30.48 28.32,29.97 26.54,29.97 21.84,25.27 21.34,25.27 20.32,24.26 19.3,24.26 18.54,23.5 17.65,23.5 v17.27,23.24 | S1.1 41.48,40.51 R2.1 C22.2 40.78,37.32 v41.15,36.96 | JP3-1.2 3.81,31.75 6.73,31.75 10.41,28.07 13.59,28.07 14.86,26.8 v14.86,26.54
  Bottom 0.203: v14.86,26.54 14.86,26.42 14.61,26.16 14.61,24.77 14.86,24.51 16.76,24.51 17.27,24 v17.27,23.24 | v38.73,33.3 38.76,33.3 41.15,35.69 v41.15,36.96
JTCK  (via drill 0.33 pad 0.69)
  Top 0.203: JP3-2.3 5.27,30.29 7.56,30.29 10.29,27.56 12.62,27.56 v12.94,27.24 | U2.76 21.59,22.61 21.46,22.48 19.95,22.48 v19.91,22.52
  Bottom 0.203: v19.91,22.52 19.91,28.63 17.36,31.18 16.07,31.18 13.14,28.26 13.14,27.45 v12.94,27.24
JTDI/TIM2_CH1  (via drill 0.33 pad 0.69)
  Top 0.203: v25.78,13.59 24.89,12.7 24.89,11.54 R24.2 | U2.77 22.09,22.1 v22.3,21.89
  Bottom 0.203: v25.78,13.59 26,13.81 26,20.1 23.88,22.23 22.61,22.23 22.3,21.92 v22.3,21.89
JTDO/TIM2_CH2  (via drill 0.33 pad 0.61)
  Top 0.203: U2.89 28.09,24.04 v27.62,25.08 | 26.54,12.95 v26.61,13.02 26.02,12.43 R25.2
  Bottom 0.203: v27.62,25.08 27.56,24.7 26.48,23.62 26.48,13.27 v26.61,13.02
JTMS  (via drill 0.33 pad 0.69)
  Top 0.203: JP3-2.2 7.54,33.02 7.54,32.97 7.75,32.77 7.75,31.37 10.54,28.57 13.99,28.57 v14.97,27.59 | U2.72 18.83,26.88 v18.34,27.37
  Bottom 0.203: v18.34,27.37 15.2,27.37 v14.97,27.59
LED1  (via drill 0.33 pad 0.69)
  Top 0.203: U2.4 32.53,26.88 v32.34,26.75 | R11.2 44.79,5.94 44.51,6.22 39.41,6.22 39.09,6.48 37.44,6.48 36.83,7.28 36.83,9.64 v36.52,9.95
  Bottom 0.203: v32.34,26.75 32.53,26.48 32.53,11.96 34.47,9.95 v36.52,9.95
LED2  (via drill 0.33 pad 0.69)
  Top 0.203: v44.83,8.76 44.83,7.75 46.23,6.35 46.23,6.08 R6.1 | 43.81,25.4 43.81,25.29 | U2.5 36.37,27.38 37.21,26.54 42.56,26.54 43.81,25.29 | 43.81,25.29 v43.84,25.27
  Bottom 0.203: v43.84,25.27 45.1,24 51.31,24 52.2,23.11 52.2,18.54 49.4,15.75 49.4,13.84 48.77,13.21 47.75,13.21 46.99,12.45 46.99,10.41 46.48,9.91 45.97,9.91 v44.83,8.76
LEDGND1
  Top 0.305: 6.54,41.91 3.76,41.91
  Top 0.406: Q2.3 6.86,41.59 6.54,41.91 | 3.76,41.91 JP4-1.1
LEDGND2
  Top 0.406: Q5.3 7.79,44.85 6.79,44.2 JP4-1.2
LEDGND3
  Top 0.406: Q3.3 8.54,35.56 6.63,37.46 6.63,38.13 5.91,38.86 4.27,38.86 JP4-2.1
LEDGND4
  Top 0.203: Q6.3 7.79,38.75
  Top 0.406: JP4-2.2 5.89,40.65 7.79,38.75
LIPO
  Top 0.203: 2.6,45.78 4,47.12 5.59,47.12 6.22,46.55 8.68,46.55 R1.2
  Top 0.254: 2.6,45.78 JP4-3.2
MISO1_LV  (via drill 0.33 pad 0.69)
  Top 0.203: U2.31 31.09,41.03 v31.14,41.34
  Bottom 0.203: U7.7 35.28,49.18 34.92,48.83 33.91,48.83 30.85,45.77 30.85,43.96 31.11,43.69 31.11,41.24 v31.14,41.34
MISO2_LV  (via drill 0.33 pad 0.69)
  Top 0.203: U2.53 20.85,36.38 21.47,35.77 22.56,35.77 22.92,36.13 29.94,36.13 31.34,37.53 32.84,37.53 34.01,38.63 35.66,40.41 v35.66,41.47 | OSD.5 44.73,42.91 v44.5,43.14
  Bottom 0.203: v35.66,41.47 35.66,41.56 36.32,42.23 37.78,42.23 38.29,42.74 41.4,42.74 41.41,42.72 41.72,42.35 43.72,42.35 v44.5,43.14
MISO3_LV  (via drill 0.33 pad 0.69)
  Top 0.203: U2.79 23.09,22.63 23.5,22.23 23.5,20.81 v23.53,20.77 | v41.15,12.95 41.27,13.08 41.27,15.88 41.15,16 40.89,16 40.51,16.38 v40.51,16.52 39.5,17.53 U1.9 | v41.81,20.82 42.61,20.82 R48.2
  Bottom 0.203: v40.51,16.52 42.66,18.66 42.66,19.96 v41.81,20.82 | v23.53,20.77 23.5,20.73 23.5,19.3 23.08,18.89 23.08,14.64 26.92,10.79 27.67,10.79 29.56,8.9 31.02,8.9 31.75,8.17 31.75,7.21 32.47,6.49 33.56,6.49 34.29,7.15 34.29,8.17 34.89,8.76 37.21,8.76 37.41,8.96 40.33,8.96 41.15,9.78 v41.15,12.95
MOSI1_LV  (via drill 0.33 pad 0.69)
  Top 0.203: v32.73,42.97 31.16,42.97 30.23,42.04 30.23,40.77 30.59,40.4 U2.32
  Bottom 0.203: U7.3 39.68,48.71 36.51,45.54 34.62,45.54 32.77,43.69 32.77,43.01 v32.73,42.97
MOSI2_LV
  Top 0.203: OSD.3 50.08,40.91 49.13,41.86 40.23,41.86 39.38,41.08 37.65,41.08 33.08,36.63 31.75,36.63 29.8,34.68 21.64,34.68 20.44,35.88 U2.54
MOSI3_LV  (via drill 0.33 pad 0.69)
  Top 0.203: v30.01,25.79 29.93,25.75 25.74,25.75 24.38,24.38 23.75,24.38 23.59,24.23 U2.80 | 34.84,15.51 34.81,15.51 34.67,15.37 33.78,15.37 33.72,15.38 R38.1
  Top 0.254: 34.84,15.51 U1.24 | R38.1 31.89,16.14 v30.86,17.17
  Bottom 0.203: v30.86,17.17 30.92,17.08 30.92,17.34 30.92,20.58 30.1,21.4 30.1,25.71 v30.01,25.79
MOT1
  Top 0.203: R20.1 13.32,8.4 JP2-3.1
MOT2
  Top 0.203: R21.1 15.86,8.14 JP2-3.2
MOT3
  Top 0.203: R22.1 18.4,8.4 JP2-3.3
MOT4
  Top 0.203: R23.1 20.94,8.14 JP2-3.4
MOT5
  Top 0.203: R24.1 23.48,8.4 JP2-3.5
MOT6
  Top 0.203: JP2-3.6 26.34,8.34 26.34,9.87 27.32,10.85 R25.1
MOT7
  Top 0.203: R31.1 29.73,9.67 JP2-3.7
MOT8
  Top 0.203: R32.1 32.4,9.41 JP2-3.8
MPU_CS  (via drill 0.33 pad 0.69)
  Top 0.203: 39.8,15.44 v39.78,15.4 | 39.9,15.24 39.9,15.28 v39.78,15.4 | 39.9,15.24 39.9,14.38 38.28,12.76 32.08,12.76 v31.9,12.94 | 39.9,15.24 C5.1 | U2.95 31.09,22.53 31.1,22.53 v31.59,22.23 | U1.8 39.36,17.03 39.62,16.76 39.62,15.55 v39.78,15.4 | R49.2 41.64,19.3 v41.36,19.33
  Bottom 0.203: v39.78,15.4 39.22,15.96 39.22,17.18 v41.36,19.33
  Bottom 0.254: v31.59,22.23 32.02,21.6 32.02,13.11 v31.9,12.94
N$1
  Top 0.203: U2.12 36.56,30.88 37.53,29.91 XT.3
N$2
  Top 0.203: U2.13 36.4,31.38 37.27,32.26 38.23,32.26 XT.1
N$3
  Top 0.203: R4.1 53.96,19.98 LED3.A
N$4
  Top 0.203: U9.6 49.53,19.31 49.91,18.92 49.91,16.78 R40.1
N$7
  Top 0.203: R6.2 LED2.A
N$9
  Top 0.203: 12.43,34.67 13.64,34.67 R9.2
  Top 0.254: Q3.1 12.43,34.67
N$10
  Top 0.254: C54.2 21.72,40.77 22.09,40.39 U2.49
N$11
  Top 0.203: 14.02,39.73 12.9,39.73 Q2.1
  Top 0.254: 14.02,39.73 R10.2
N$12
  Top 0.203: Q5.1 9.95,43.84 10.31,43.75 R12.2
N$15
  Top 0.203: R11.1 LED1.A
N$23
  Top 0.254: Q6.1 11.1,37.59 R13.2
N$28
  Top 0.203: U2.73 18.58,26.38 18.29,26.67 17.41,26.67 C41.1
N$34
  Top 0.203: LED4.A 44.11,44.03 43.67,44.65 42.69,44.65 41.21,43.16 40.01,43.16 R57.2
N$36
  Top 0.203: U2.19 36.49,34.38 37.08,34.04 39.42,34.04 R45.2 R58.2
N$41
  Top 0.203: U9.8 48.99,20.8 49.4,21.21 49.4,21.99 C21.1
N$42
  Top 0.203: U9.12 46.88,21.2 46.48,21.59 46.48,22.11 C21.2
N$67
  Top 0.203: C24.+ 50.93,21.35 C20.+ 50.69,21.7 49.15,23.62 48.01,23.62 47.88,23.5 U9.10
N$72
  Top 0.203: 41.91,46.78 40.29,45.16 38.22,45.16 | 38.22,45.16 R35.2 | 38.22,45.16 38.22,43.95 R62.1
  Top 0.254: X2.D+ 41.91,46.78
N$74
  Top 0.203: R26.2 40.64,44.75 42.71,46.82 X2.D-
NSS1_LV/DAC_OUT1  (via drill 0.33 pad 0.69)
  Top 0.203: v20.02,39.05 20.28,38.88 22.9,36.58 26.94,36.58 26.81,36.58 29.8,36.58 31.62,38.4 32.03,38.4 U2.29 | JP3-2.9 3.81,16.51 3.81,23.75 4.19,24.13 5.97,24.13 7.75,25.91 7.75,26.41 v8.02,26.68
  Bottom 0.203: v20.02,39.05 20.02,40.54 18.35,42.22 18.35,43.45 15.24,46.55 10.37,46.55 7.75,43.99 7.75,26.95 v8.02,26.68
NSS2_LV
  Top 0.203: 18.74,37.38 18.74,37.15 15.49,33.91 10.03,33.91 9.78,33.66 U3.2 | U2.51 18.74,37.38 | U13.2 17.96,39.37 R64.2 18.74,38.59 18.74,37.38
PD8
  Top 0.203: U2.55 17.6,35.38 15.62,33.4 10.85,33.4 U3.1
PD9  (via drill 0.33 pad 0.69)
  Top 0.203: U13.4 14.99,40.02 14.99,38.05 v15.02,38.02 | U2.56 18.3,34.88 v18.17,34.74
  Bottom 0.203: v15.02,38.02 v18.17,34.74
PD11  (via drill 0.33 pad 0.69)
  Top 0.203: v27.68,33.85 27.18,34.29 21.14,34.29 20.79,33.94 20.79,33.88 U2.58 | v27.74,35.4 29.84,35.4 31.55,37.11 32.99,37.11 38.04,42.03 38.04,42.47 R62.2
  Bottom 0.203: v27.68,33.85 27.74,33.91 v27.74,35.4
PE10  (via drill 0.33 pad 0.61, 0.33 pad 0.69)
  Top 0.203: R53.2 28.65,46.18 v29.42,45.67 | U2.41 26.09,40.44 v25.96,40.56
  Bottom 0.203: U7.2 40.96,49.64 40.96,52.7 40.32,53.34 36.51,53.34 35.88,52.7 35.88,51.75 35.69,51.56 33.53,51.56 33.15,51.18 33.15,49.91 32.13,48.9 29.84,48.9 29.42,48.47 v29.42,45.67 27.25,45.67 26.8,45.21 26.8,41.65 v25.96,40.56
PLED1  (via drill 0.33 pad 0.69)
  Top 0.203: v18.18,41.47 17.08,42.06 15.55,42.06 R12.1 | U2.88 27.59,24.1 v26.68,25.01
  Bottom 0.203: v18.18,41.47 18.18,38.81 23.69,33.47 23.66,32.41 28.14,27.96 28.14,27.1 28.32,26.92 28.32,26.04 28.07,25.78 27.3,25.78 26.67,25.15 v26.67,25.02 v26.68,25.01
PLED2  (via drill 0.33 pad 0.69)
  Top 0.203: R10.1 13.97,40.69 15.97,40.69 16.45,40.2 v16.45,39.24 | U2.97 32.09,24.72 30.32,26.42 v27.6,26.42
  Bottom 0.203: v16.45,39.24 16.45,38.98 27.6,27.84 v27.6,26.42
PLED3  (via drill 0.33 pad 0.69)
  Top 0.203: U2.98 32.59,24.85 30.51,26.92 28.19,26.92 28.04,27.08 26.9,27.08 v26.27,26.45 | v16.29,35.61 15.64,35.61 R9.1
  Bottom 0.203: v26.27,26.45 26.27,27.69 19.77,34.12 17.78,34.12 v16.29,35.61
PLED4  (via drill 0.33 pad 0.69)
  Top 0.203: v16.96,37.02 14.4,37.02 13.38,38.1 R13.1 | U2.85 26.09,24.31 v25.64,24.75
  Bottom 0.203: v25.64,24.75 25.64,24.91 26.94,26.21 26.94,27.67 17.59,37.02 v16.96,37.02
RCV1
  Top 0.203: R19.1 16.51,47.24 17.91,48.64 20.72,48.64 JP1-2.5
RCV2
  Top 0.203: R18.1 15.24,47.12 17.53,49.4 19.2,49.4 JP1-2.4
RCV3
  Top 0.203: JP1-2.3 17.81,50.34 R29.1
RCV4
  Top 0.203: R30.1 12.7,47.62 15.11,50.04 15.11,50.4 JP1-2.2
RCV5
  Top 0.203: R14.1 21.59,46.86 24.13,49.4 24.13,52.11 JP1-1.5
RCV6  (via drill 0.33 pad 0.69)
  Top 0.203: R15.1 v20.32,47.5
  Bottom 0.203: v20.32,47.5 21.59,48.77 21.59,51.86 JP1-1.4
RCV7  (via drill 0.33 pad 0.69)
  Top 0.203: R16.1 v19.05,47.5
  Bottom 0.203: v19.05,47.5 19.05,52.11 JP1-1.3
RCV8  (via drill 0.33 pad 0.69)
  Top 0.203: R17.1 v17.78,47.5
  Bottom 0.203: v17.78,47.5 16.51,48.77 16.51,51.86 JP1-1.2
SCK1_LV/DAC_OUT2  (via drill 0.33 pad 0.69)
  Top 0.203: U2.30 31.62,39.41 31.62,40.13 31.75,40.26 31.75,41.86 v32.14,42.25
  Bottom 0.203: v32.14,42.25 32,42.52 32,43.69 33.27,44.96 33.27,46.48 34.04,47.24 34.92,47.24 37.47,49.78 37.47,50.47 U7.5
SCK2_LV  (via drill 0.33 pad 0.69)
  Top 0.203: OSD.4 50.61,41.91 50.17,42.35 43.63,42.35 43.18,42.8 43.18,43.96 v43.21,43.99 | U2.52 21.64,36.88 v22.03,36.49 | v29.47,42.47 29.65,42.42 29.59,42.42 30.61,43.43 32.13,43.43 32.38,43.69 33.08,43.69 v33.53,43.49
  Bottom 0.203: v29.47,42.47 29.26,42.69 27.83,42.69 27.3,42.16 27.3,41.44 26.7,40.58 26.7,38 25.19,36.49 v22.03,36.49 | v33.53,43.49 33.53,43.69 34.92,45.09 36.73,45.09 38.48,46.84 40.16,46.84 41.66,45.34 41.86,45.34 v43.21,43.99
SCK3_LV  (via drill 0.33 pad 0.69)
  Top 0.203: 21.83,20.32 v21.78,20.34 22.99,21.61 22.99,22.16 22.59,22.56 U2.78 | 29.09,10.56 29.09,12.89 29.79,13.59 v34.15,13.59 35.57,13.59 R37.1
  Top 0.254: v27.06,9.55 27.86,9.55 29.09,10.56 | U1.23 34.29,17.05 33.88,16.64 33.88,16.18 v34.02,15.99 | 35.52,13.7 R37.1
  Bottom 0.203: v21.78,20.34 21.72,20.21 21.72,14.48 26.67,9.53 27.04,9.53 v27.06,9.55
  Bottom 0.254: v34.15,13.59 34.15,15.87
  Bottom 0.305: 34.15,15.87 v34.02,15.99
SCL1_LV  (via drill 0.33, 0.33 pad 0.69)
  Top 0.203: U1.7 38.83,15.79 v38.83,15.34 | U2.92 29.59,21.7 29.21,21.32 R27.2 29.2,21.21 28.95,21.21 v28.15,20.41 | v28.14,16.23 28.68,15.68 30.92,15.68 32.52,14.09 33.59,14.09 33.99,14.42 36.76,14.42 36.96,14.22 36.96,13.58 R37.2 | U10.8 45.64,29.67 45.59,29.72 41.91,29.72 v41.27,29.08 | U9.1 46.88,16.39 v46.86,16.26
  Top 0.254: 38.83,15.79 38.83,14.05 38.32,13.54 R37.2
  Bottom 0.203: v28.14,16.23 28.14,20.21 v28.15,20.41 | v41.27,29.08 41.25,29.11 40.49,29.11 38.83,27.45 v38.83,15.34 39.7,14.48 42.42,14.48 44.45,16.51 46.74,16.51 v46.86,16.26
SCL2_LV  (via drill 0.33 pad 0.69)
  Top 0.203: v51.98,29.54 53.21,28.38 53.21,25.51 52.6,24.9 I2C.2 | v25.91,47.98 26.71,48.76 26.71,51.73 27.05,52.07 29.15,52.07 v29.23,52.15 | R33.2 24.13,41.15 | 24.13,41.15 24.13,41.05 | 24.13,41.15 24.9,41.15 v25.58,41.83
  Top 0.254: 24.13,41.05 24.13,40.64 23.97,40.48 23.33,40.48 23.09,40.24 U2.47
  Bottom 0.203: v29.23,52.15 29.24,52.41 29.24,53.88 30.61,55.24 43.75,55.24 45.09,53.91 45.09,50.61 51.91,43.79 51.91,29.61 v51.98,29.54 | v25.58,41.83 25.78,42.04 25.78,47.85 v25.91,47.98
SDA1_LV  (via drill 0.33, 0.33 pad 0.69)
  Top 0.203: 38.08,15.45 U1.6 | R38.2 32.46,14.84 30.92,16.38 v30.23,16.38 | R28.2 30.48,20.89 30.48,20.45 v30.23,20.19 | v39.24,28.83 41.21,30.79 45.81,30.79 U10.7 | U9.16 46.26,17.17 45.97,16.89 v45.97,15.88
  Top 0.254: R38.2 33.28,14.83 33.47,14.91 37.78,14.91 38.1,15.1 U1.6 38.1,15.3 38.1,14.33 v38.12,14.31 | U2.93 30.09,22.36 30.35,22.1 30.35,21.22 R28.2
  Bottom 0.203: v45.97,15.88 44.7,15.88 42.93,14.1 38.33,14.1 v38.12,14.31 38.08,14.35 U1.6 38.35,16.05 38.35,27.69 39.24,28.57 v39.24,28.83 | v30.23,20.19 v30.23,16.38
SDA2_LV  (via drill 0.33 pad 0.69)
  Top 0.203: 22.86,41.12 22.86,41.15 | v25.09,42.61 25.02,42.54 25.02,42.16 24.78,41.93 23.53,41.93 R34.2 | v51.09,29.67 51.09,29.3 52.83,27.56 52.83,26.16 52.58,25.91 51.64,25.91 I2C.3
  Top 0.254: U2.48 22.59,40.37 22.86,40.64 22.86,41.15 R34.2
  Bottom 0.203: v51.09,29.67 51.22,29.8 51.22,43.46 43.12,51.56 43.12,53.34 41.85,54.67 32.38,54.67 32.13,54.42 32.13,52.32 31.63,51.83 29.95,51.83 29.25,51.13 29.25,50.3 27.63,48.67 25.43,48.67 25.08,48.32 v25.08,42.62 v25.09,42.61
SERVO1
  Top 0.203: JP2-3.12 42.37,9.16 42.37,10.98 R7.1
SERVO2
  Top 0.203: JP2-3.11 39.07,8.68 39.07,10.86 39.37,11.16 39.37,11.18 39.62,11.43 R5.1
SERVO3
  Top 0.203: 37.08,11.43 R36.1 37.21,11.41 37.08,10.92 36.83,10.67 36.32,10.67 35.81,10.16 35.81,7.75 JP2-3.10
TIM1_CH1
  Top 0.203: U2.40 26.59,43.45 25.72,44.32 22.46,44.32 R14.2
TIM1_CH2  (via drill 0.33 pad 0.69)
  Top 0.203: U2.42 25.59,38.53 25.5,38.44 v25.5,38.26 | R15.2 20.32,44.47 20.33,44.2 v20.46,44.1
  Bottom 0.203: v25.5,38.26 25.5,39.06 v20.46,44.1
TIM1_CH3  (via drill 0.33 pad 0.69)
  Top 0.203: v24.61,38.19 24.59,38.21 U2.44
  Top 0.254: v19.46,44.13 19.36,44.13 19.05,44.45 R16.2
  Bottom 0.203: v24.61,38.19 24.61,38.85 19.46,44 v19.46,44.13
TIM1_CH4  (via drill 0.33 pad 0.69)
  Top 0.203: v19.47,42.97 19.4,42.85 17.78,44.47 R17.2 | v23.64,38.14 23.83,38.14 24.09,38.65 U2.45
  Bottom 0.203: v23.64,38.14 23.66,38.76 v19.47,42.97
TIM3_CH1  (via drill 0.33 pad 0.69)
  Top 0.203: U2.90 28.59,24.64 v28.48,24.75 | R31.2 28.56,11.6 28.56,12.33 28.45,12.45 27.96,12.45 v27.84,12.57
  Bottom 0.203: v28.48,24.75 26.89,23.16 26.89,13.88 27.69,13.08 27.69,12.72 v27.84,12.57
TIM3_CH2  (via drill 0.33 pad 0.69)
  Top 0.203: U2.91 29.09,22.53 29.07,22.27 v28.89,22.22 | R60.1 28.69,18.86 v28.84,18.71 | v30.73,10.41 30.86,10.41 31.11,10.67 31.11,11.41 R32.2
  Bottom 0.203: v28.89,22.22 28.84,21.95 v28.84,18.71 28.84,14.34 30.35,12.83 30.35,10.79 v30.73,10.41
TIM3_CH3  (via drill 0.33 pad 0.69)
  Top 0.203: U2.35 29.09,40.4 v29.38,40.69
  Bottom 0.203: JP2-3.9 32.38,8.38 32.38,10.29 30.73,11.94 30.73,13.08 29.56,14.25 29.56,25.28 29.32,25.53 29.32,26.16 29.51,26.35 29.51,40.56 v29.38,40.69
TIM3_CH4  (via drill 0.33 pad 0.69)
  Top 0.203: v22.75,38.14 23.43,37.45 26.3,37.45 27.25,38.4 28.59,38.4 U2.36
  Bottom 0.203: v22.75,38.14 22.75,38.7 18.83,42.62 18.83,43.78 13.72,48.77 13.72,49.15 13.97,49.4 13.97,51.94 13.84,52.07 11.43,52.07 10.92,51.56 10.92,50.16 6.38,45.63 6.38,37.37 6.1,37.08 4.32,37.08 3.81,36.58 3.81,24.13 JP3-2.6
TIM4_CH1  (via drill 0.33 pad 0.69)
  Top 0.203: U2.59 16.53,33.38 16.53,33.36 16.13,32.96 11.64,32.96 v11.34,32.66 | R19.2 16.51,44.58 16.13,44.2 15.51,44.2 v15.33,44.01
  Bottom 0.203: v11.34,32.66 11.12,32.78 10.5,33.41 10.5,41.86 12.65,44.01 v15.33,44.01
TIM4_CH2  (via drill 0.33 pad 0.69)
  Top 0.203: U2.60 22.67,32.88 v23.03,33.25 | R18.2 15.24,45.09 14.61,44.45 14.61,43.69 15.75,42.55 17.41,42.55 v17.56,42.53
  Bottom 0.203: v23.03,33.25 17.56,38.72 v17.56,42.53
TIM4_CH3  (via drill 0.33 pad 0.69)
  Top 0.203: v13.21,40.68 13.21,44.39 13.91,45.09 R29.2 | U2.61 12.8,32.38 v12.72,32.3
  Bottom 0.203: v13.21,40.68 13.21,40.65 12.57,40.01 12.57,33.78 12.83,33.53 12.83,32.32 v12.72,32.3
TIM4_CH4  (via drill 0.33 pad 0.69)
  Top 0.203: U2.62 16.2,31.88 15.48,31.17 v11.3,31.17 | R30.2 12.18,45.2 v11.59,44.61
  Bottom 0.203: v11.59,44.61 9.95,42.97 9.95,32.78 v11.3,31.17
TIM5_CH1  (via drill 0.33 pad 0.69)
  Top 0.203: U2.23 34.74,36.38 34.67,34.89 v33.66,34.45 | R36.2 34.93,11.43 v34.85,11.5
  Bottom 0.203: v33.66,34.45 33.4,33.94 33.4,32.13 32.96,31.43 32.95,12.95 32.95,12.77 34.16,11.56 34.8,11.56 v34.85,11.5
TIM5_CH2  (via drill 0.33 pad 0.69)
  Top 0.203: U2.24 34.58,36.88 v34.06,36.11 | R5.2 38.34,10.33 v38.3,10.29
  Bottom 0.203: v34.06,36.11 34.42,35.76 34.42,34.04 33.78,33.4 33.78,31.88 33.45,31.3 33.45,20.67 34.76,19.36 34.76,13.83 v38.3,10.29
TIM5_CH3  (via drill 0.33 pad 0.69)
  Top 0.203: U2.25 36.49,37.38 36.7,37.59 36.7,37.92 v36.82,38.03 | R7.2 41.26,10.91 40.89,10.54 39.98,10.54 v39.79,10.48
  Bottom 0.203: v36.82,38.03 35.92,37.14 35.92,22.4 35.18,21.66 35.18,14.22 38.1,11.3 38.97,11.3 v39.79,10.48
TIM5_CH4  (via drill 0.33 pad 0.69)
  Top 0.203: v36.63,41.52 35.93,42.1 35.24,42.1 34.92,41.78 34.92,40.46 33.84,39.38 U2.26 | OSD.2 49.72,39.91 v49.7,39.93
  Bottom 0.203: 36.61,41.51 v36.63,41.52 37.72,41.52 38.48,42.29 41.02,42.29 41.4,41.91 47.72,41.91 v49.7,39.93
TIM8_CH1  (via drill 0.33 pad 0.69)
  Top 0.203: U2.63 20.25,31.38 20.76,30.73 v21.38,30.36 | v21.37,13.15 22.24,12.28 R23.2
  Bottom 0.203: v21.38,30.36 21.53,30.28 21.53,29.3 21.03,28.74 21.03,21.79 20.45,21.21 20.45,14.07 v21.37,13.15
TIM8_CH2  (via drill 0.33 pad 0.69)
  Top 0.203: v13.74,17.85 15.06,16.52 15.06,13.25 15.55,12.76 17.59,12.76 18.07,13.25 19.24,13.25 19.7,12.79 R22.2 | U2.64 17.5,30.88 v17,30.5
  Bottom 0.203: v17,30.5 16.82,30.61 16.13,30.61 13.67,28.09 13.67,17.91 v13.74,17.85
TIM8_CH3  (via drill 0.33 pad 0.69)
  Top 0.203: U2.65 20.38,30.38 20.7,29.89 v20.84,29.49 | v18.97,12.49 18.08,12.49 17.78,12.19 17.27,12.19 17.14,12.06 17.14,11.45 R21.2
  Bottom 0.203: v20.84,29.49 20.57,29.22 20.57,22.22 19.94,21.59 19.94,13.46 v18.97,12.49
TIM8_CH4  (via drill 0.33 pad 0.69)
  Top 0.203: U2.66 17.69,29.88 v16.98,29.18 | v14.14,16.34 14.62,15.86 R20.2
  Bottom 0.203: v14.14,16.34 14.59,16.86 14.59,18.35 14.18,18.75 14.18,27.84 15.52,29.18 v16.98,29.18
UART1_RX
  Top 0.203: R8.2 17.89,28.19 18.08,28.38 U2.69 22.02,28.38 26.39,32.74 28.62,32.74 32.02,36.14 33.23,36.14 34.73,37.66 37.8,40.66 39.59,40.66 40.31,41.38 48.54,41.38 48.9,41.02 48.9,37.75 49.2,37.45 50.51,37.45 52.79,35.16 52.79,33.74 52.58,33.53 51.64,33.53 SERIAL.3
UART1_TX  (via drill 0.33 pad 0.69)
  Top 0.203: v53.09,32.52 SERIAL.2 | U2.68 18.67,28.88 v18.4,29.15
  Bottom 0.203: v18.4,29.15 19.45,28.11 19.45,23.47 19.25,23.28 19.25,22.02 19.43,21.84 19.43,13.99 18.29,12.85 18.29,10.92 19.56,9.65 20.19,9.65 21.59,8.26 21.59,4.61 22.26,3.94 24.04,3.94 24.31,3.67 26.13,3.67 26.67,3.13 26.67,1.93 27.31,1.29 29.44,1.29 29.59,1.14 31.37,1.14 31.5,1.27 33.69,1.27 34.29,1.87 34.29,3.11 34.86,3.68 36.65,3.68 36.91,3.94 39.15,3.94 39.41,3.68 42.62,3.68 53.19,14.25 53.19,32.43 v53.09,32.52
UART2_RX  (via drill 0.33 pad 0.69)
  Top 0.203: v29.71,12.38 29.83,12.27 43.09,12.27 45.22,9.97 48.76,9.97 50.55,11.76 50.55,12.32 50.7,12.47 GPS.2 | U2.87 27.09,22.47 v27.55,22.02
  Bottom 0.203: v27.55,22.02 27.48,21.7 27.48,15.76 28.32,14.92 28.32,14.1 29.59,12.83 29.59,12.5 v29.71,12.38
UART2_TX  (via drill 0.33 pad 0.69)
  Top 0.203: v43.05,9.01 43.43,9.39 48.78,9.39 50.86,11.47 GPS.1 | v22.79,20.04 22.85,19.98 23.79,19.98 24.19,20.38 24.19,21.91 24.7,22.42 26.42,22.42 26.59,22.59 U2.86
  Bottom 0.203: v22.79,20.04 22.47,19.73 22.47,14.49 26.68,10.27 26.7,10.29 27.43,10.29 29.2,8.52 29.2,4.3 29.82,3.68 31.62,3.68 31.88,3.94 33.68,3.94 34.29,4.55 34.29,5.53 34.99,6.24 36.59,6.24 36.83,6.48 39.24,6.48 39.5,6.22 41.4,6.22 42.04,6.86 42.04,8 v43.05,9.01
UART3_RX
  Top 0.203: U13.1 17.84,38.72 17.84,36.91 17.18,36.26 15.17,36.26 14.82,35.91 13.49,35.91 13.12,35.54 11.59,35.54 10.91,34.86 7.68,34.86 6.99,35.56 JP3-2.1
UART3_TX
  Top 0.203: JP3-1.1 3.79,34.31 7.72,34.31 8.26,33.78 8.26,32.16 U3.4
USBDM  (via drill 0.33 pad 0.69)
  Top 0.203: U2.70 22.28,27.88 26.65,32.25 28.76,32.25 31.86,35.36 v33.55,35.36 | R26.1 41.57,42.53 v42.04,43
  Bottom 0.203: v42.04,43 41.9,43.12 37.97,43.12 37.53,42.67 35.69,42.67 34.92,41.91 34.92,41.53 34.67,41.27 33.91,41.27 33.66,41.02 33.66,36.83 33.4,36.58 33.4,35.63 | 33.4,35.63 v33.55,35.36 33.4,35.5 33.4,35.63
USBDP  (via drill 0.33 pad 0.69)
  Top 0.203: U2.71 22.48,27.38 26.87,31.77 28.97,31.77 31.11,33.91 31.52,33.91 v31.66,33.89 | v35.87,44.25 v35.88,44.25 35.88,44.45 36.52,45.09 36.55,45.09 R35.1 37.08,44.98 37.08,44.07 36.84,43.83 R61.2
  Top 0.254: R61.2
  Bottom 0.203: v31.66,33.89 31.41,34.21 31.41,39.28 32.51,40.39 32.51,41.53 33.66,42.67 34.3,42.67 v35.87,44.25 35.87,44.23
VBUS
  Top 0.406: X2.VBUS 43.52,46.21 D3.2

## Text on the board
tPlace: 8 | 7 | 6 | 5 | Y | GND | GND | GND | BOOT0 | Z | X | 4 | 3 | 2 | 1 | 5V | RSSI | 3V3 | 3V3 | + | BM | - | 2 | 1 | 3 | 4 | OSD | LED | SBUS | U10 | SW / DIO | SER | SW / CLK | 5V | AI2 | I2C | AI3 | U9 | AI4 | U1 | AI5 | MODEM | GND | GPS | 1 | 2 | 3 | 4 | 5 | 6 | 7 | 8 | RNG | 1 | 2 | 3 | - | + | S | + | Motors | - | AQ32 / v2.0.2 | Camera
bPlace: µSD input | Special Thanks: | Honk, Ala42 | aadamson | Krat, KirAsh4 | AeroQuad Forums